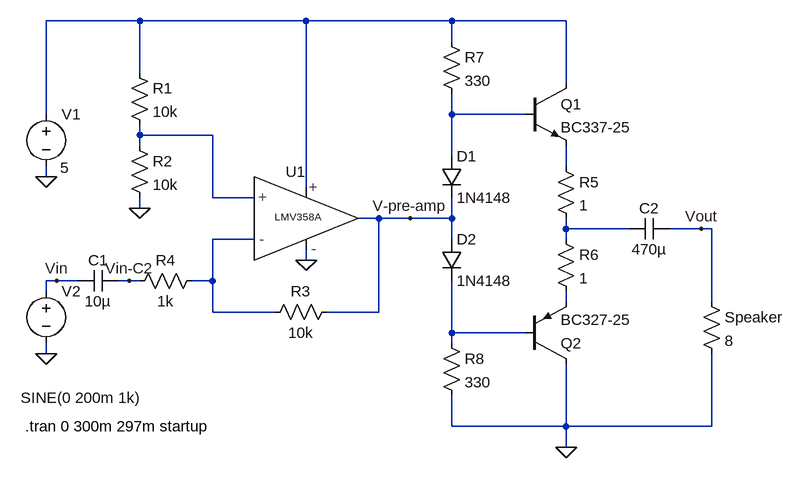
[diagram p0: schematic amplifier.asc]
amplifier.asc, the LTspice schematic file:
Version 4.1
SHEET 1 880 680
WIRE -144 -112 -288 -112
WIRE 112 -112 -144 -112
WIRE 336 -112 112 -112
WIRE 512 -112 336 -112
WIRE 336 -80 336 -112
WIRE -144 -32 -144 -112
WIRE 512 -16 512 -112
WIRE -288 32 -288 -112
WIRE 336 32 336 0
WIRE 448 32 336 32
WIRE -144 64 -144 48
WIRE -32 64 -144 64
WIRE -144 80 -144 64
WIRE 336 96 336 32
WIRE 512 112 512 80
WIRE -288 128 -288 112
WIRE 112 144 112 -112
WIRE -32 160 -32 64
WIRE 32 160 -32 160
WIRE -144 176 -144 160
WIRE 224 192 192 192
WIRE 272 192 224 192
WIRE 336 192 336 160
WIRE 336 192 272 192
WIRE 512 208 512 192
WIRE 608 208 512 208
WIRE 720 208 672 208
WIRE 736 208 720 208
WIRE 32 224 -32 224
WIRE 336 224 336 192
WIRE 512 224 512 208
WIRE 112 256 112 240
WIRE -272 288 -288 288
WIRE -240 288 -272 288
WIRE -160 288 -176 288
WIRE -144 288 -160 288
WIRE -32 288 -32 224
WIRE -32 288 -64 288
WIRE -288 304 -288 288
WIRE 512 320 512 304
WIRE 736 320 736 208
WIRE -32 336 -32 288
WIRE 64 336 -32 336
WIRE 224 336 224 192
WIRE 224 336 144 336
WIRE 336 368 336 288
WIRE 448 368 336 368
WIRE 336 384 336 368
WIRE -288 400 -288 384
WIRE 336 512 336 464
WIRE 512 512 512 416
WIRE 512 512 336 512
WIRE 736 512 736 400
WIRE 736 512 512 512
WIRE 512 544 512 512
FLAG -288 128 0
FLAG -288 400 0
FLAG -144 176 0
FLAG 112 256 0
FLAG 512 544 0
FLAG -272 288 Vin
FLAG -160 288 Vin-C2
FLAG 272 192 V-pre-amp
FLAG 720 208 Vout
SYMBOL res -160 -48 R0
SYMATTR InstName R1
SYMATTR Value 10k
SYMBOL res -160 64 R0
SYMATTR InstName R2
SYMATTR Value 10k
SYMBOL res 160 320 R90
WINDOW 0 0 56 VBottom 2
WINDOW 3 32 56 VTop 2
SYMATTR InstName R3
SYMATTR Value 10k
SYMBOL res -48 272 R90
WINDOW 0 0 56 VBottom 2
WINDOW 3 32 56 VTop 2
SYMATTR InstName R4
SYMATTR Value 1k
SYMBOL voltage -288 16 R0
WINDOW 123 0 0 Left 0
WINDOW 39 0 0 Left 0
WINDOW 3 22 98 Left 2
SYMATTR Value 5
SYMATTR InstName V1
SYMBOL voltage -288 288 R0
WINDOW 123 0 0 Left 0
WINDOW 39 0 0 Left 0
WINDOW 3 -39 180 Left 2
SYMATTR Value SINE(0 200m 1k)
SYMATTR InstName V2
SYMBOL cap -176 272 R90
WINDOW 0 0 32 VBottom 2
WINDOW 3 32 32 VTop 2
SYMATTR InstName C1
SYMATTR Value 10µ
SYMBOL diode 320 96 R0
SYMATTR InstName D1
SYMATTR Value 1N4148
SYMBOL diode 320 224 R0
SYMATTR InstName D2
SYMATTR Value 1N4148
SYMBOL npn 448 -16 R0
SYMATTR InstName Q1
SYMATTR Value BC337-25
SYMBOL pnp 448 416 M180
SYMATTR InstName Q2
SYMATTR Value BC327-25
SYMBOL res 496 96 R0
SYMATTR InstName R5
SYMATTR Value 1
SYMBOL res 496 208 R0
SYMATTR InstName R6
SYMATTR Value 1
SYMBOL res 320 -96 R0
SYMATTR InstName R7
SYMATTR Value 330
SYMBOL res 320 368 R0
SYMATTR InstName R8
SYMATTR Value 330
SYMBOL cap 672 192 R90
WINDOW 0 0 32 VBottom 2
WINDOW 3 32 32 VTop 2
SYMATTR InstName C2
SYMATTR Value 470µ
SYMBOL res 720 304 R0
SYMATTR InstName Speaker
SYMATTR Value 8
SYMBOL LMV358A 96 192 R0
SYMATTR InstName U1
TEXT -320 512 Left 2 !.tran 0 300m 297m startup

The netlist it stands for:
* amplifier.asc
R1 N001 N003 10k
R2 N003 0 10k
R3 V-pre-amp N006 10k
R4 N006 Vin-C2 1k
V1 N001 0 5
V2 Vin 0 SINE(0 200m 1k)
C1 Vin-C2 Vin 10µ
D1 N002 V-pre-amp 1N4148
D2 V-pre-amp N008 1N4148
Q1 N001 N002 N004 0 BC337-25
Q2 0 N008 N007 0 BC327-25
R5 N004 N005 1
R6 N005 N007 1
R7 N001 N002 330
R8 N008 0 330
C2 Vout N005 470µ
R§Speaker Vout 0 8
X§U1 N003 N006 N001 0 V-pre-amp LMV358A  ; pins IN+ IN- VCC VEE OUT
.model D D
.lib standard.dio
.model NPN NPN
.model PNP PNP
.lib standard.bjt
.tran 0 300m 297m startup
.lib lmv358a.lib
.backanno
.end